# EAGLE schematic LEDS (EAGLE 8.0.1)
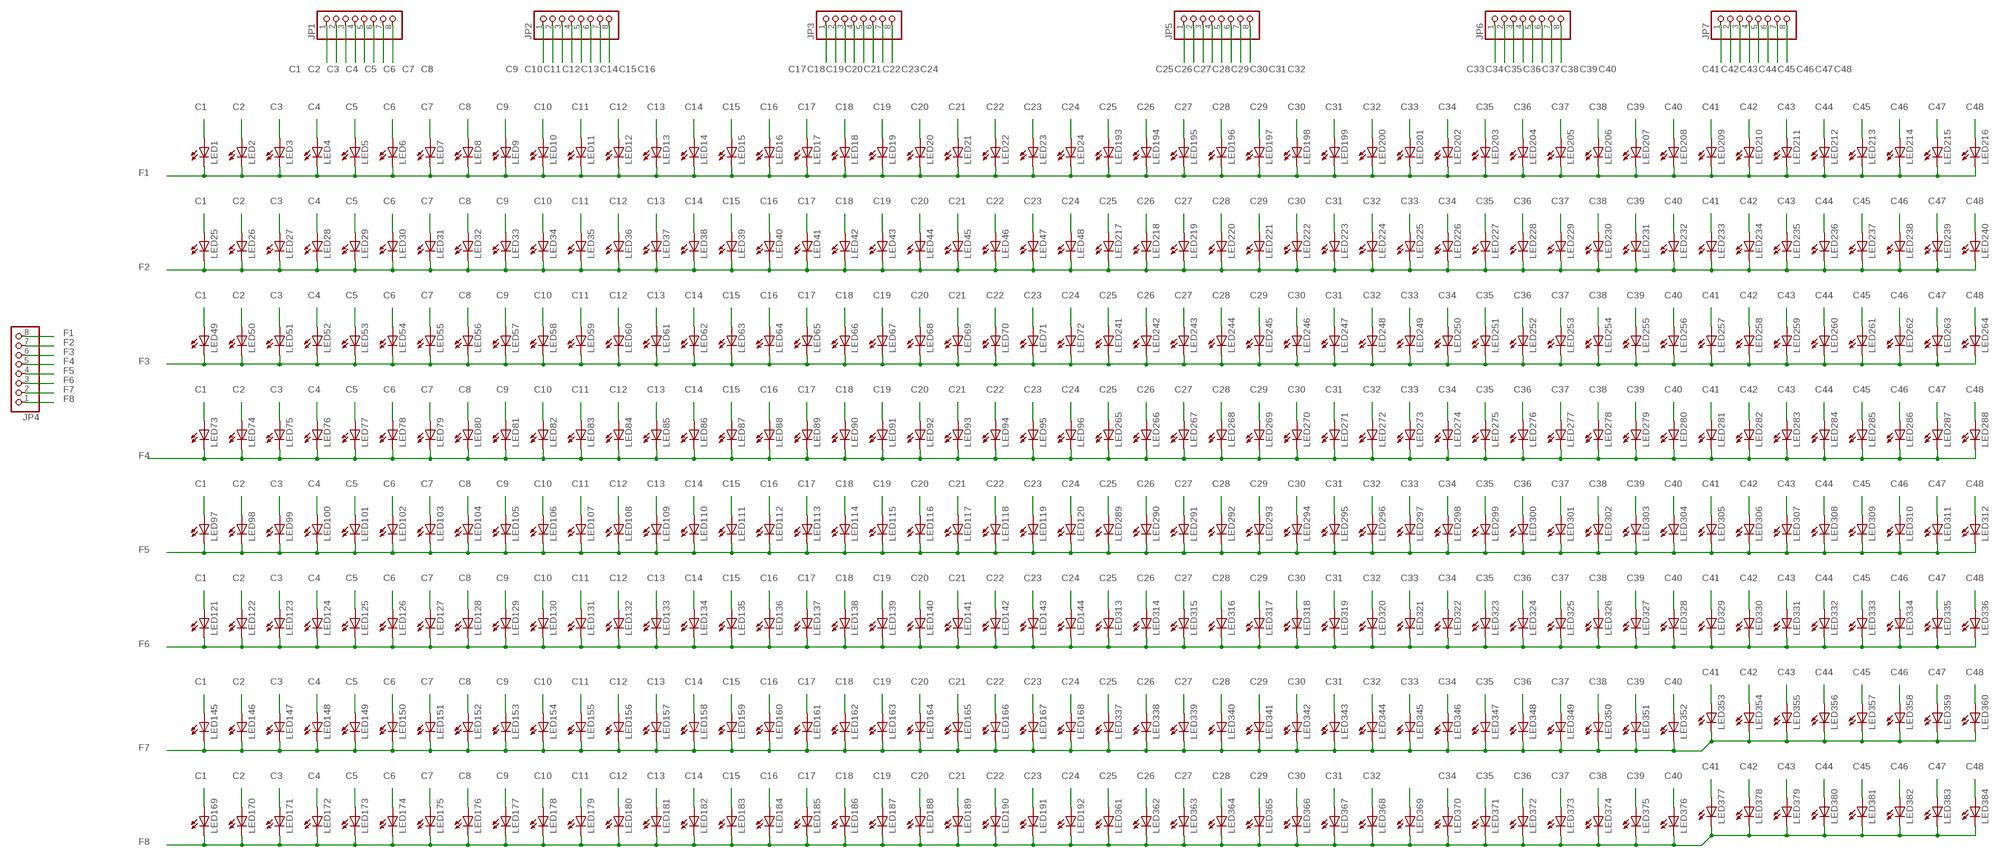
[diagram p0: schematic, sheet 1]

## Parts
JP1  PINHD-1X8  [1X08]
JP2  PINHD-1X8  [1X08]
JP3  PINHD-1X8  [1X08]
JP4  PINHD-1X8  [1X08]
JP5  PINHD-1X8  [1X08]
JP6  PINHD-1X8  [1X08]
JP7  PINHD-1X8  [1X08]
LED1  LED5MM  [LED5MM]
LED2  LED5MM  [LED5MM]
LED3  LED5MM  [LED5MM]
LED4  LED5MM  [LED5MM]
LED5  LED5MM  [LED5MM]
LED6  LED5MM  [LED5MM]
LED7  LED5MM  [LED5MM]
LED8  LED5MM  [LED5MM]
LED9  LED5MM  [LED5MM]
LED10  LED5MM  [LED5MM]
LED11  LED5MM  [LED5MM]
LED12  LED5MM  [LED5MM]
LED13  LED5MM  [LED5MM]
LED14  LED5MM  [LED5MM]
LED15  LED5MM  [LED5MM]
LED16  LED5MM  [LED5MM]
LED17  LED5MM  [LED5MM]
LED18  LED5MM  [LED5MM]
LED19  LED5MM  [LED5MM]
LED20  LED5MM  [LED5MM]
LED21  LED5MM  [LED5MM]
LED22  LED5MM  [LED5MM]
LED23  LED5MM  [LED5MM]
LED24  LED5MM  [LED5MM]
LED25  LED5MM  [LED5MM]
LED26  LED5MM  [LED5MM]
LED27  LED5MM  [LED5MM]
LED28  LED5MM  [LED5MM]
LED29  LED5MM  [LED5MM]
LED30  LED5MM  [LED5MM]
LED31  LED5MM  [LED5MM]
LED32  LED5MM  [LED5MM]
LED33  LED5MM  [LED5MM]
LED34  LED5MM  [LED5MM]
LED35  LED5MM  [LED5MM]
LED36  LED5MM  [LED5MM]
LED37  LED5MM  [LED5MM]
LED38  LED5MM  [LED5MM]
LED39  LED5MM  [LED5MM]
LED40  LED5MM  [LED5MM]
LED41  LED5MM  [LED5MM]
LED42  LED5MM  [LED5MM]
LED43  LED5MM  [LED5MM]
LED44  LED5MM  [LED5MM]
LED45  LED5MM  [LED5MM]
LED46  LED5MM  [LED5MM]
LED47  LED5MM  [LED5MM]
LED48  LED5MM  [LED5MM]
LED49  LED5MM  [LED5MM]
LED50  LED5MM  [LED5MM]
LED51  LED5MM  [LED5MM]
LED52  LED5MM  [LED5MM]
LED53  LED5MM  [LED5MM]
LED54  LED5MM  [LED5MM]
LED55  LED5MM  [LED5MM]
LED56  LED5MM  [LED5MM]
LED57  LED5MM  [LED5MM]
LED58  LED5MM  [LED5MM]
LED59  LED5MM  [LED5MM]
LED60  LED5MM  [LED5MM]
LED61  LED5MM  [LED5MM]
LED62  LED5MM  [LED5MM]
LED63  LED5MM  [LED5MM]
LED64  LED5MM  [LED5MM]
LED65  LED5MM  [LED5MM]
LED66  LED5MM  [LED5MM]
LED67  LED5MM  [LED5MM]
LED68  LED5MM  [LED5MM]
LED69  LED5MM  [LED5MM]
LED70  LED5MM  [LED5MM]
LED71  LED5MM  [LED5MM]
LED72  LED5MM  [LED5MM]
LED73  LED5MM  [LED5MM]
LED74  LED5MM  [LED5MM]
LED75  LED5MM  [LED5MM]
LED76  LED5MM  [LED5MM]
LED77  LED5MM  [LED5MM]
LED78  LED5MM  [LED5MM]
LED79  LED5MM  [LED5MM]
LED80  LED5MM  [LED5MM]
LED81  LED5MM  [LED5MM]
LED82  LED5MM  [LED5MM]
LED83  LED5MM  [LED5MM]
LED84  LED5MM  [LED5MM]
LED85  LED5MM  [LED5MM]
LED86  LED5MM  [LED5MM]
LED87  LED5MM  [LED5MM]
LED88  LED5MM  [LED5MM]
LED89  LED5MM  [LED5MM]
LED90  LED5MM  [LED5MM]
LED91  LED5MM  [LED5MM]
LED92  LED5MM  [LED5MM]
LED93  LED5MM  [LED5MM]
LED94  LED5MM  [LED5MM]
LED95  LED5MM  [LED5MM]
LED96  LED5MM  [LED5MM]
LED97  LED5MM  [LED5MM]
LED98  LED5MM  [LED5MM]
LED99  LED5MM  [LED5MM]
LED100  LED5MM  [LED5MM]
LED101  LED5MM  [LED5MM]
LED102  LED5MM  [LED5MM]
LED103  LED5MM  [LED5MM]
LED104  LED5MM  [LED5MM]
LED105  LED5MM  [LED5MM]
LED106  LED5MM  [LED5MM]
LED107  LED5MM  [LED5MM]
LED108  LED5MM  [LED5MM]
LED109  LED5MM  [LED5MM]
LED110  LED5MM  [LED5MM]
LED111  LED5MM  [LED5MM]
LED112  LED5MM  [LED5MM]
LED113  LED5MM  [LED5MM]
LED114  LED5MM  [LED5MM]
LED115  LED5MM  [LED5MM]
LED116  LED5MM  [LED5MM]
LED117  LED5MM  [LED5MM]
LED118  LED5MM  [LED5MM]
LED119  LED5MM  [LED5MM]
LED120  LED5MM  [LED5MM]
LED121  LED5MM  [LED5MM]
LED122  LED5MM  [LED5MM]
LED123  LED5MM  [LED5MM]
LED124  LED5MM  [LED5MM]
LED125  LED5MM  [LED5MM]
LED126  LED5MM  [LED5MM]
LED127  LED5MM  [LED5MM]
LED128  LED5MM  [LED5MM]
LED129  LED5MM  [LED5MM]
LED130  LED5MM  [LED5MM]
LED131  LED5MM  [LED5MM]
LED132  LED5MM  [LED5MM]
LED133  LED5MM  [LED5MM]
LED134  LED5MM  [LED5MM]
LED135  LED5MM  [LED5MM]
LED136  LED5MM  [LED5MM]
LED137  LED5MM  [LED5MM]
LED138  LED5MM  [LED5MM]
LED139  LED5MM  [LED5MM]
LED140  LED5MM  [LED5MM]
LED141  LED5MM  [LED5MM]
LED142  LED5MM  [LED5MM]
LED143  LED5MM  [LED5MM]
LED144  LED5MM  [LED5MM]
LED145  LED5MM  [LED5MM]
LED146  LED5MM  [LED5MM]
LED147  LED5MM  [LED5MM]
LED148  LED5MM  [LED5MM]
LED149  LED5MM  [LED5MM]
LED150  LED5MM  [LED5MM]
LED151  LED5MM  [LED5MM]
LED152  LED5MM  [LED5MM]
LED153  LED5MM  [LED5MM]
LED154  LED5MM  [LED5MM]
LED155  LED5MM  [LED5MM]
LED156  LED5MM  [LED5MM]
LED157  LED5MM  [LED5MM]
LED158  LED5MM  [LED5MM]
LED159  LED5MM  [LED5MM]
LED160  LED5MM  [LED5MM]
LED161  LED5MM  [LED5MM]
LED162  LED5MM  [LED5MM]
LED163  LED5MM  [LED5MM]
LED164  LED5MM  [LED5MM]
LED165  LED5MM  [LED5MM]
LED166  LED5MM  [LED5MM]
LED167  LED5MM  [LED5MM]
LED168  LED5MM  [LED5MM]
LED169  LED5MM  [LED5MM]
LED170  LED5MM  [LED5MM]
LED171  LED5MM  [LED5MM]
LED172  LED5MM  [LED5MM]
LED173  LED5MM  [LED5MM]
LED174  LED5MM  [LED5MM]
LED175  LED5MM  [LED5MM]
LED176  LED5MM  [LED5MM]
LED177  LED5MM  [LED5MM]
LED178  LED5MM  [LED5MM]
LED179  LED5MM  [LED5MM]
LED180  LED5MM  [LED5MM]
LED181  LED5MM  [LED5MM]
LED182  LED5MM  [LED5MM]
LED183  LED5MM  [LED5MM]
LED184  LED5MM  [LED5MM]
LED185  LED5MM  [LED5MM]
LED186  LED5MM  [LED5MM]
LED187  LED5MM  [LED5MM]
LED188  LED5MM  [LED5MM]
LED189  LED5MM  [LED5MM]
LED190  LED5MM  [LED5MM]
LED191  LED5MM  [LED5MM]
LED192  LED5MM  [LED5MM]
LED193  LED5MM  [LED5MM]
LED194  LED5MM  [LED5MM]
LED195  LED5MM  [LED5MM]
LED196  LED5MM  [LED5MM]
LED197  LED5MM  [LED5MM]
LED198  LED5MM  [LED5MM]
LED199  LED5MM  [LED5MM]
LED200  LED5MM  [LED5MM]
LED201  LED5MM  [LED5MM]
LED202  LED5MM  [LED5MM]
LED203  LED5MM  [LED5MM]
LED204  LED5MM  [LED5MM]
LED205  LED5MM  [LED5MM]
LED206  LED5MM  [LED5MM]
LED207  LED5MM  [LED5MM]
LED208  LED5MM  [LED5MM]
LED209  LED5MM  [LED5MM]
LED210  LED5MM  [LED5MM]
LED211  LED5MM  [LED5MM]
LED212  LED5MM  [LED5MM]
LED213  LED5MM  [LED5MM]
LED214  LED5MM  [LED5MM]
LED215  LED5MM  [LED5MM]
LED216  LED5MM  [LED5MM]
LED217  LED5MM  [LED5MM]
LED218  LED5MM  [LED5MM]
LED219  LED5MM  [LED5MM]
LED220  LED5MM  [LED5MM]
LED221  LED5MM  [LED5MM]
LED222  LED5MM  [LED5MM]
LED223  LED5MM  [LED5MM]
LED224  LED5MM  [LED5MM]
LED225  LED5MM  [LED5MM]
LED226  LED5MM  [LED5MM]
LED227  LED5MM  [LED5MM]
LED228  LED5MM  [LED5MM]
LED229  LED5MM  [LED5MM]
LED230  LED5MM  [LED5MM]
LED231  LED5MM  [LED5MM]
LED232  LED5MM  [LED5MM]
LED233  LED5MM  [LED5MM]
LED234  LED5MM  [LED5MM]
LED235  LED5MM  [LED5MM]
LED236  LED5MM  [LED5MM]
LED237  LED5MM  [LED5MM]
LED238  LED5MM  [LED5MM]
LED239  LED5MM  [LED5MM]
LED240  LED5MM  [LED5MM]
LED241  LED5MM  [LED5MM]
LED242  LED5MM  [LED5MM]
LED243  LED5MM  [LED5MM]
LED244  LED5MM  [LED5MM]
LED245  LED5MM  [LED5MM]
LED246  LED5MM  [LED5MM]
LED247  LED5MM  [LED5MM]
LED248  LED5MM  [LED5MM]
LED249  LED5MM  [LED5MM]
LED250  LED5MM  [LED5MM]
LED251  LED5MM  [LED5MM]
LED252  LED5MM  [LED5MM]
LED253  LED5MM  [LED5MM]
LED254  LED5MM  [LED5MM]
LED255  LED5MM  [LED5MM]
LED256  LED5MM  [LED5MM]
LED257  LED5MM  [LED5MM]
LED258  LED5MM  [LED5MM]
LED259  LED5MM  [LED5MM]
LED260  LED5MM  [LED5MM]
LED261  LED5MM  [LED5MM]
LED262  LED5MM  [LED5MM]
LED263  LED5MM  [LED5MM]
LED264  LED5MM  [LED5MM]
LED265  LED5MM  [LED5MM]
LED266  LED5MM  [LED5MM]
LED267  LED5MM  [LED5MM]
LED268  LED5MM  [LED5MM]
LED269  LED5MM  [LED5MM]
LED270  LED5MM  [LED5MM]
LED271  LED5MM  [LED5MM]
LED272  LED5MM  [LED5MM]
LED273  LED5MM  [LED5MM]
LED274  LED5MM  [LED5MM]
LED275  LED5MM  [LED5MM]
LED276  LED5MM  [LED5MM]
LED277  LED5MM  [LED5MM]
LED278  LED5MM  [LED5MM]
LED279  LED5MM  [LED5MM]
LED280  LED5MM  [LED5MM]
LED281  LED5MM  [LED5MM]
LED282  LED5MM  [LED5MM]
LED283  LED5MM  [LED5MM]
LED284  LED5MM  [LED5MM]
LED285  LED5MM  [LED5MM]
LED286  LED5MM  [LED5MM]
LED287  LED5MM  [LED5MM]
LED288  LED5MM  [LED5MM]
LED289  LED5MM  [LED5MM]
LED290  LED5MM  [LED5MM]
LED291  LED5MM  [LED5MM]
LED292  LED5MM  [LED5MM]
LED293  LED5MM  [LED5MM]
LED294  LED5MM  [LED5MM]
LED295  LED5MM  [LED5MM]
LED296  LED5MM  [LED5MM]
LED297  LED5MM  [LED5MM]
LED298  LED5MM  [LED5MM]
LED299  LED5MM  [LED5MM]
LED300  LED5MM  [LED5MM]
LED301  LED5MM  [LED5MM]
LED302  LED5MM  [LED5MM]
LED303  LED5MM  [LED5MM]
LED304  LED5MM  [LED5MM]
LED305  LED5MM  [LED5MM]
LED306  LED5MM  [LED5MM]
LED307  LED5MM  [LED5MM]
LED308  LED5MM  [LED5MM]
LED309  LED5MM  [LED5MM]
LED310  LED5MM  [LED5MM]
LED311  LED5MM  [LED5MM]
LED312  LED5MM  [LED5MM]
LED313  LED5MM  [LED5MM]
LED314  LED5MM  [LED5MM]
LED315  LED5MM  [LED5MM]
LED316  LED5MM  [LED5MM]
LED317  LED5MM  [LED5MM]
LED318  LED5MM  [LED5MM]
LED319  LED5MM  [LED5MM]
LED320  LED5MM  [LED5MM]
LED321  LED5MM  [LED5MM]
LED322  LED5MM  [LED5MM]
LED323  LED5MM  [LED5MM]
LED324  LED5MM  [LED5MM]
LED325  LED5MM  [LED5MM]
LED326  LED5MM  [LED5MM]
LED327  LED5MM  [LED5MM]
LED328  LED5MM  [LED5MM]
LED329  LED5MM  [LED5MM]
LED330  LED5MM  [LED5MM]
LED331  LED5MM  [LED5MM]
LED332  LED5MM  [LED5MM]
LED333  LED5MM  [LED5MM]
LED334  LED5MM  [LED5MM]
LED335  LED5MM  [LED5MM]
LED336  LED5MM  [LED5MM]
LED337  LED5MM  [LED5MM]
LED338  LED5MM  [LED5MM]
LED339  LED5MM  [LED5MM]
LED340  LED5MM  [LED5MM]
LED341  LED5MM  [LED5MM]
LED342  LED5MM  [LED5MM]
LED343  LED5MM  [LED5MM]
LED344  LED5MM  [LED5MM]
LED345  LED5MM  [LED5MM]
LED346  LED5MM  [LED5MM]
LED347  LED5MM  [LED5MM]
LED348  LED5MM  [LED5MM]
LED349  LED5MM  [LED5MM]
LED350  LED5MM  [LED5MM]
LED351  LED5MM  [LED5MM]
LED352  LED5MM  [LED5MM]
LED353  LED5MM  [LED5MM]
LED354  LED5MM  [LED5MM]
LED355  LED5MM  [LED5MM]
LED356  LED5MM  [LED5MM]
LED357  LED5MM  [LED5MM]
LED358  LED5MM  [LED5MM]
LED359  LED5MM  [LED5MM]
LED360  LED5MM  [LED5MM]
LED361  LED5MM  [LED5MM]
LED362  LED5MM  [LED5MM]
LED363  LED5MM  [LED5MM]
LED364  LED5MM  [LED5MM]
LED365  LED5MM  [LED5MM]
LED366  LED5MM  [LED5MM]
LED367  LED5MM  [LED5MM]
LED368  LED5MM  [LED5MM]
LED369  LED5MM  [LED5MM]
LED370  LED5MM  [LED5MM]
LED371  LED5MM  [LED5MM]
LED372  LED5MM  [LED5MM]
LED373  LED5MM  [LED5MM]
LED374  LED5MM  [LED5MM]
LED375  LED5MM  [LED5MM]
LED376  LED5MM  [LED5MM]
LED377  LED5MM  [LED5MM]
LED378  LED5MM  [LED5MM]
LED379  LED5MM  [LED5MM]
LED380  LED5MM  [LED5MM]
LED381  LED5MM  [LED5MM]
LED382  LED5MM  [LED5MM]
LED383  LED5MM  [LED5MM]
LED384  LED5MM  [LED5MM]

## Nets
C1: JP1.1 LED1.A LED25.A LED49.A LED73.A LED97.A LED121.A LED145.A LED169.A
C2: JP1.2 LED2.A LED26.A LED50.A LED74.A LED98.A LED122.A LED146.A LED170.A
C3: JP1.3 LED3.A LED27.A LED51.A LED75.A LED99.A LED123.A LED147.A LED171.A
C4: JP1.4 LED4.A LED28.A LED52.A LED76.A LED100.A LED124.A LED148.A LED172.A
C5: JP1.5 LED5.A LED29.A LED53.A LED77.A LED101.A LED125.A LED149.A LED173.A
C6: JP1.6 LED6.A LED30.A LED54.A LED78.A LED102.A LED126.A LED150.A LED174.A
C7: JP1.7 LED7.A LED31.A LED55.A LED79.A LED103.A LED127.A LED151.A LED175.A
C8: JP1.8 LED8.A LED32.A LED56.A LED80.A LED104.A LED128.A LED152.A LED176.A
C9: JP2.1 LED9.A LED33.A LED57.A LED81.A LED105.A LED129.A LED153.A LED177.A
C10: JP2.2 LED10.A LED34.A LED58.A LED82.A LED106.A LED130.A LED154.A LED178.A
C11: JP2.3 LED11.A LED35.A LED59.A LED83.A LED107.A LED131.A LED155.A LED179.A
C12: JP2.4 LED12.A LED36.A LED60.A LED84.A LED108.A LED132.A LED156.A LED180.A
C13: JP2.5 LED13.A LED37.A LED61.A LED85.A LED109.A LED133.A LED157.A LED181.A
C14: JP2.6 LED14.A LED38.A LED62.A LED86.A LED110.A LED134.A LED158.A LED182.A
C15: JP2.7 LED15.A LED39.A LED63.A LED87.A LED111.A LED135.A LED159.A LED183.A
C16: JP2.8 LED16.A LED40.A LED64.A LED88.A LED112.A LED136.A LED160.A LED184.A
C17: JP3.1 LED17.A LED41.A LED65.A LED89.A LED113.A LED137.A LED161.A LED185.A
C18: JP3.2 LED18.A LED42.A LED66.A LED90.A LED114.A LED138.A LED162.A LED186.A
C19: JP3.3 LED19.A LED43.A LED67.A LED91.A LED115.A LED139.A LED163.A LED187.A
C20: JP3.4 LED20.A LED44.A LED68.A LED92.A LED116.A LED140.A LED164.A LED188.A
C21: JP3.5 LED21.A LED45.A LED69.A LED93.A LED117.A LED141.A LED165.A LED189.A
C22: JP3.6 LED22.A LED46.A LED70.A LED94.A LED118.A LED142.A LED166.A LED190.A
C23: JP3.7 LED23.A LED47.A LED71.A LED95.A LED119.A LED143.A LED167.A LED191.A
C24: JP3.8 LED24.A LED48.A LED72.A LED96.A LED120.A LED144.A LED168.A LED192.A
C25: JP5.1 LED193.A LED217.A LED241.A LED265.A LED289.A LED313.A LED337.A LED361.A
C26: JP5.2 LED194.A LED218.A LED242.A LED266.A LED290.A LED314.A LED338.A LED362.A
C27: JP5.3 LED195.A LED219.A LED243.A LED267.A LED291.A LED315.A LED339.A LED363.A
C28: JP5.4 LED196.A LED220.A LED244.A LED268.A LED292.A LED316.A LED340.A LED364.A
C29: JP5.5 LED197.A LED221.A LED245.A LED269.A LED293.A LED317.A LED341.A LED365.A
C30: JP5.6 LED198.A LED222.A LED246.A LED270.A LED294.A LED318.A LED342.A LED366.A
C31: JP5.7 LED199.A LED223.A LED247.A LED271.A LED295.A LED319.A LED343.A LED367.A
C32: JP5.8 LED200.A LED224.A LED248.A LED272.A LED296.A LED320.A LED344.A LED368.A
C33: JP6.1 LED201.A LED225.A LED249.A LED273.A LED297.A LED321.A LED345.A
C34: JP6.2 LED202.A LED226.A LED250.A LED274.A LED298.A LED322.A LED346.A LED370.A
C35: JP6.3 LED203.A LED227.A LED251.A LED275.A LED299.A LED323.A LED347.A LED371.A
C36: JP6.4 LED204.A LED228.A LED252.A LED276.A LED300.A LED324.A LED348.A LED372.A
C37: JP6.5 LED205.A LED229.A LED253.A LED277.A LED301.A LED325.A LED349.A LED373.A
C38: JP6.6 LED206.A LED230.A LED254.A LED278.A LED302.A LED326.A LED350.A LED374.A
C39: JP6.7 LED207.A LED231.A LED255.A LED279.A LED303.A LED327.A LED351.A LED375.A
C40: JP6.8 LED208.A LED232.A LED256.A LED280.A LED304.A LED328.A LED352.A LED376.A
C41: JP7.1 LED209.A LED233.A LED257.A LED281.A LED305.A LED329.A LED353.A LED369.A LED377.A
C42: JP7.2 LED210.A LED234.A LED258.A LED282.A LED306.A LED330.A LED354.A LED378.A
C43: JP7.3 LED211.A LED235.A LED259.A LED283.A LED307.A LED331.A LED355.A LED379.A
C44: JP7.4 LED212.A LED236.A LED260.A LED284.A LED308.A LED332.A LED356.A LED380.A
C45: JP7.5 LED213.A LED237.A LED261.A LED285.A LED309.A LED333.A LED357.A LED381.A
C46: JP7.6 LED214.A LED238.A LED262.A LED286.A LED310.A LED334.A LED358.A LED382.A
C47: JP7.7 LED215.A LED239.A LED263.A LED287.A LED311.A LED335.A LED359.A LED383.A
C48: JP7.8 LED216.A LED240.A LED264.A LED288.A LED312.A LED336.A LED360.A LED384.A
F1: JP4.8 LED1.K(C) LED2.K(C) LED3.K(C) LED4.K(C) LED5.K(C) LED6.K(C) LED7.K(C) LED8.K(C) LED9.K(C) LED10.K(C) LED11.K(C) LED12.K(C) LED13.K(C) LED14.K(C) LED15.K(C) LED16.K(C) LED17.K(C) LED18.K(C) LED19.K(C) LED20.K(C) LED21.K(C) LED22.K(C) LED23.K(C) LED24.K(C) LED193.K(C) LED194.K(C) LED195.K(C) LED196.K(C) LED197.K(C) LED198.K(C) LED199.K(C) LED200.K(C) LED201.K(C) LED202.K(C) LED203.K(C) LED204.K(C) LED205.K(C) LED206.K(C) LED207.K(C) LED208.K(C) LED209.K(C) LED210.K(C) LED211.K(C) LED212.K(C) LED213.K(C) LED214.K(C) LED215.K(C) LED216.K(C)
F2: JP4.7 LED25.K(C) LED26.K(C) LED27.K(C) LED28.K(C) LED29.K(C) LED30.K(C) LED31.K(C) LED32.K(C) LED33.K(C) LED34.K(C) LED35.K(C) LED36.K(C) LED37.K(C) LED38.K(C) LED39.K(C) LED40.K(C) LED41.K(C) LED42.K(C) LED43.K(C) LED44.K(C) LED45.K(C) LED46.K(C) LED47.K(C) LED48.K(C) LED217.K(C) LED218.K(C) LED219.K(C) LED220.K(C) LED221.K(C) LED222.K(C) LED223.K(C) LED224.K(C) LED225.K(C) LED226.K(C) LED227.K(C) LED228.K(C) LED229.K(C) LED230.K(C) LED231.K(C) LED232.K(C) LED233.K(C) LED234.K(C) LED235.K(C) LED236.K(C) LED237.K(C) LED238.K(C) LED239.K(C) LED240.K(C)
F3: JP4.6 LED49.K(C) LED50.K(C) LED51.K(C) LED52.K(C) LED53.K(C) LED54.K(C) LED55.K(C) LED56.K(C) LED57.K(C) LED58.K(C) LED59.K(C) LED60.K(C) LED61.K(C) LED62.K(C) LED63.K(C) LED64.K(C) LED65.K(C) LED66.K(C) LED67.K(C) LED68.K(C) LED69.K(C) LED70.K(C) LED71.K(C) LED72.K(C) LED241.K(C) LED242.K(C) LED243.K(C) LED244.K(C) LED245.K(C) LED246.K(C) LED247.K(C) LED248.K(C) LED249.K(C) LED250.K(C) LED251.K(C) LED252.K(C) LED253.K(C) LED254.K(C) LED255.K(C) LED256.K(C) LED257.K(C) LED258.K(C) LED259.K(C) LED260.K(C) LED261.K(C) LED262.K(C) LED263.K(C) LED264.K(C)
F4: JP4.5 LED73.K(C) LED74.K(C) LED75.K(C) LED76.K(C) LED77.K(C) LED78.K(C) LED79.K(C) LED80.K(C) LED81.K(C) LED82.K(C) LED83.K(C) LED84.K(C) LED85.K(C) LED86.K(C) LED87.K(C) LED88.K(C) LED89.K(C) LED90.K(C) LED91.K(C) LED92.K(C) LED93.K(C) LED94.K(C) LED95.K(C) LED96.K(C) LED265.K(C) LED266.K(C) LED267.K(C) LED268.K(C) LED269.K(C) LED270.K(C) LED271.K(C) LED272.K(C) LED273.K(C) LED274.K(C) LED275.K(C) LED276.K(C) LED277.K(C) LED278.K(C) LED279.K(C) LED280.K(C) LED281.K(C) LED282.K(C) LED283.K(C) LED284.K(C) LED285.K(C) LED286.K(C) LED287.K(C) LED288.K(C)
F5: JP4.4 LED97.K(C) LED98.K(C) LED99.K(C) LED100.K(C) LED101.K(C) LED102.K(C) LED103.K(C) LED104.K(C) LED105.K(C) LED106.K(C) LED107.K(C) LED108.K(C) LED109.K(C) LED110.K(C) LED111.K(C) LED112.K(C) LED113.K(C) LED114.K(C) LED115.K(C) LED116.K(C) LED117.K(C) LED118.K(C) LED119.K(C) LED120.K(C) LED289.K(C) LED290.K(C) LED291.K(C) LED292.K(C) LED293.K(C) LED294.K(C) LED295.K(C) LED296.K(C) LED297.K(C) LED298.K(C) LED299.K(C) LED300.K(C) LED301.K(C) LED302.K(C) LED303.K(C) LED304.K(C) LED305.K(C) LED306.K(C) LED307.K(C) LED308.K(C) LED309.K(C) LED310.K(C) LED311.K(C) LED312.K(C)
F6: JP4.3 LED121.K(C) LED122.K(C) LED123.K(C) LED124.K(C) LED125.K(C) LED126.K(C) LED127.K(C) LED128.K(C) LED129.K(C) LED130.K(C) LED131.K(C) LED132.K(C) LED133.K(C) LED134.K(C) LED135.K(C) LED136.K(C) LED137.K(C) LED138.K(C) LED139.K(C) LED140.K(C) LED141.K(C) LED142.K(C) LED143.K(C) LED144.K(C) LED313.K(C) LED314.K(C) LED315.K(C) LED316.K(C) LED317.K(C) LED318.K(C) LED319.K(C) LED320.K(C) LED321.K(C) LED322.K(C) LED323.K(C) LED324.K(C) LED325.K(C) LED326.K(C) LED327.K(C) LED328.K(C) LED329.K(C) LED330.K(C) LED331.K(C) LED332.K(C) LED333.K(C) LED334.K(C) LED335.K(C) LED336.K(C)
F7: JP4.2 LED145.K(C) LED146.K(C) LED147.K(C) LED148.K(C) LED149.K(C) LED150.K(C) LED151.K(C) LED152.K(C) LED153.K(C) LED154.K(C) LED155.K(C) LED156.K(C) LED157.K(C) LED158.K(C) LED159.K(C) LED160.K(C) LED161.K(C) LED162.K(C) LED163.K(C) LED164.K(C) LED165.K(C) LED166.K(C) LED167.K(C) LED168.K(C) LED337.K(C) LED338.K(C) LED339.K(C) LED340.K(C) LED341.K(C) LED342.K(C) LED343.K(C) LED344.K(C) LED345.K(C) LED346.K(C) LED347.K(C) LED348.K(C) LED349.K(C) LED350.K(C) LED351.K(C) LED352.K(C) LED353.K(C) LED354.K(C) LED355.K(C) LED356.K(C) LED357.K(C) LED358.K(C) LED359.K(C) LED360.K(C)
F8: JP4.1 LED169.K(C) LED170.K(C) LED171.K(C) LED172.K(C) LED173.K(C) LED174.K(C) LED175.K(C) LED176.K(C) LED177.K(C) LED178.K(C) LED179.K(C) LED180.K(C) LED181.K(C) LED182.K(C) LED183.K(C) LED184.K(C) LED185.K(C) LED186.K(C) LED187.K(C) LED188.K(C) LED189.K(C) LED190.K(C) LED191.K(C) LED192.K(C) LED361.K(C) LED362.K(C) LED363.K(C) LED364.K(C) LED365.K(C) LED366.K(C) LED367.K(C) LED368.K(C) LED369.K(C) LED370.K(C) LED371.K(C) LED372.K(C) LED373.K(C) LED374.K(C) LED375.K(C) LED376.K(C) LED377.K(C) LED378.K(C) LED379.K(C) LED380.K(C) LED381.K(C) LED382.K(C) LED383.K(C) LED384.K(C)

## Library data of the parts
JP1-JP7 = pinhead:PINHD-1X8: PIN HEADER
LED1-LED384 = led:LED: LED OSRAM: - CHIPLED LG R971, LG N971, LY N971, LG Q971, LY Q971, LO R971, LY R971 LH N974, LH R974 LS Q976, LO Q976, LY Q976 LO Q996 - Hyper CHIPLED LW Q18S LB Q993, LB Q99A, LB R99A - SideLED LS A670, LO A670, LY A670, LG A670, LP A670 LB A673, LV A673, LT A673, LW A673 LH A674 LY A675 LS A676, LA A676, LO A676, LY A676, LW A676 LS A679, LY A679, LG A679 - Hyper Micro SIDELED® LS Y876, LA Y876, LO Y876, LY Y876 LT Y87S - SmartLED LW L88C, LW L88S LB L89C, LB L89S, LG L890 LS L89K, LO L89K, LY L89K LS L896, LA L896, LO L896, LY L896 - TOPLED LS T670, LO T670, LY T670, LG T670, LP T670 LSG T670, LSP T670, LSY T670, LOP T670, LYG T670 LG T671, LOG T671, LSG T671 LB T673, LV T673, LT T673, LW T673 LH T674 LS T676, LA T676, LO T676, LY T676, LB T676, LH T676, LSB T676, LW T676 LB T67C, LV T67C, LT T67C, LS T67K, LO T67K, LY T67K, LW E67C LS E67B, LA E67B, LO E67B, LY E67B, LB E67C, LV E67C, LT E67C LW T67C LS T679, LY T679, LG T679 LS T770, LO T770, LY T770, LG T770, LP T770 LB T773, LV T773, LT T773, LW T773 LH T774 LS E675, LA E675, LY E675, LS T675 LS T776, LA T776, LO T776, LY T776, LB T776 LHGB T686 LT T68C, LB T68C - Hyper Mini TOPLED® LB M676 - Mini TOPLED Santana® LG M470 LS M47K, LO M47K, LY M47K Source: http://www.osram.convergy.de LUXEON: - LUMILED® LXK2-PW12-R00, LXK2-PW12-S00, LXK2-PW14-U00, LXK2-PW14-V00 LXK2-PM12-R00, LXK2-PM12-S00, LXK2-PM14-U00 LXK2-PE12-Q00, LXK2-PE12-R00, LXK2-PE12-S00, LXK2-PE14-T00, LXK2-PE14-U00 LXK2-PB12-K00, LXK2-PB12-L00, LXK2-PB12-M00, LXK2-PB14-N00, LXK2-PB14-P00, LXK2-PB14-Q00 LXK2-PR12-L00, LXK2-PR12-M00, LXK2-PR14-Q00, LXK2-PR14-R00 LXK2-PD12-Q00, LXK2-PD12-R00, LXK2-PD12-S00 LXK2-PH12-R00, LXK2-PH12-S00 LXK2-PL12-P00, LXK2-PL12-Q00, LXK2-PL12-R00 Source: www.luxeon.com KINGBRIGHT: KA-3528ASYC Source: www.kingbright.com